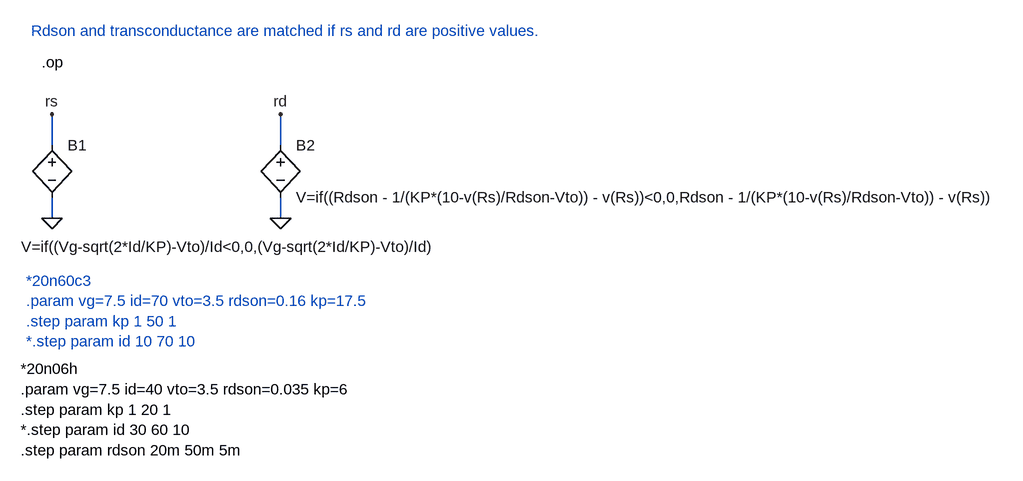
[diagram p0: schematic parameter_extraction.asc]
parameter_extraction.asc, the LTspice schematic file:
Version 4
SHEET 1 1376 680
WIRE -224 -160 -224 -208
WIRE 128 -160 128 -208
WIRE -224 -48 -224 -80
WIRE 128 -48 128 -80
FLAG -224 -48 0
FLAG 128 -48 0
FLAG -224 -208 rs
FLAG 128 -208 rd
SYMBOL bv -224 -176 R0
WINDOW 3 -47 172 Left 0
SYMATTR Value V=if((Vg-sqrt(2*Id/KP)-Vto)/Id<0,0,(Vg-sqrt(2*Id/KP)-Vto)/Id)
SYMATTR InstName B1
SYMBOL bv 128 -176 R0
SYMATTR InstName B2
SYMATTR Value V=if((Rdson - 1/(KP*(10-v(Rs)/Rdson-Vto)) - v(Rs))<0,0,Rdson - 1/(KP*(10-v(Rs)/Rdson-Vto)) - v(Rs))
TEXT -264 48 Left 0 ;*20n60c3\n.param vg=7.5 id=70 vto=3.5 rdson=0.16 kp=17.5\n.step param kp 1 50 1\n*.step param id 10 70 10
TEXT -240 -288 Left 0 !.op
TEXT -272 184 Left 0 !*20n06h\n.param vg=7.5 id=40 vto=3.5 rdson=0.035 kp=6\n.step param kp 1 20 1\n*.step param id 30 60 10\n.step param rdson 20m 50m 5m
TEXT -256 -336 Left 0 ;Rdson and transconductance are matched if rs and rd are positive values.

The netlist it stands for:
* parameter_extraction.asc
B1 rs 0 V=if((Vg-sqrt(2*Id/KP)-Vto)/Id<0,0,(Vg-sqrt(2*Id/KP)-Vto)/Id)
B2 rd 0 V=if((Rdson - 1/(KP*(10-v(Rs)/Rdson-Vto)) - v(Rs))<0,0,Rdson - 1/(KP*(10-v(Rs)/Rdson-Vto)) - v(Rs))
* *20n60c3
* .param vg=7.5 id=70 vto=3.5 rdson=0.16 kp=17.5
* .step param kp 1 50 1
* *.step param id 10 70 10
.op
*20n06h
.param vg=7.5 id=40 vto=3.5 rdson=0.035 kp=6
.step param kp 1 20 1
*.step param id 30 60 10
.step param rdson 20m 50m 5m
* Rdson and transconductance are matched if rs and rd are positive values.
.backanno
.end